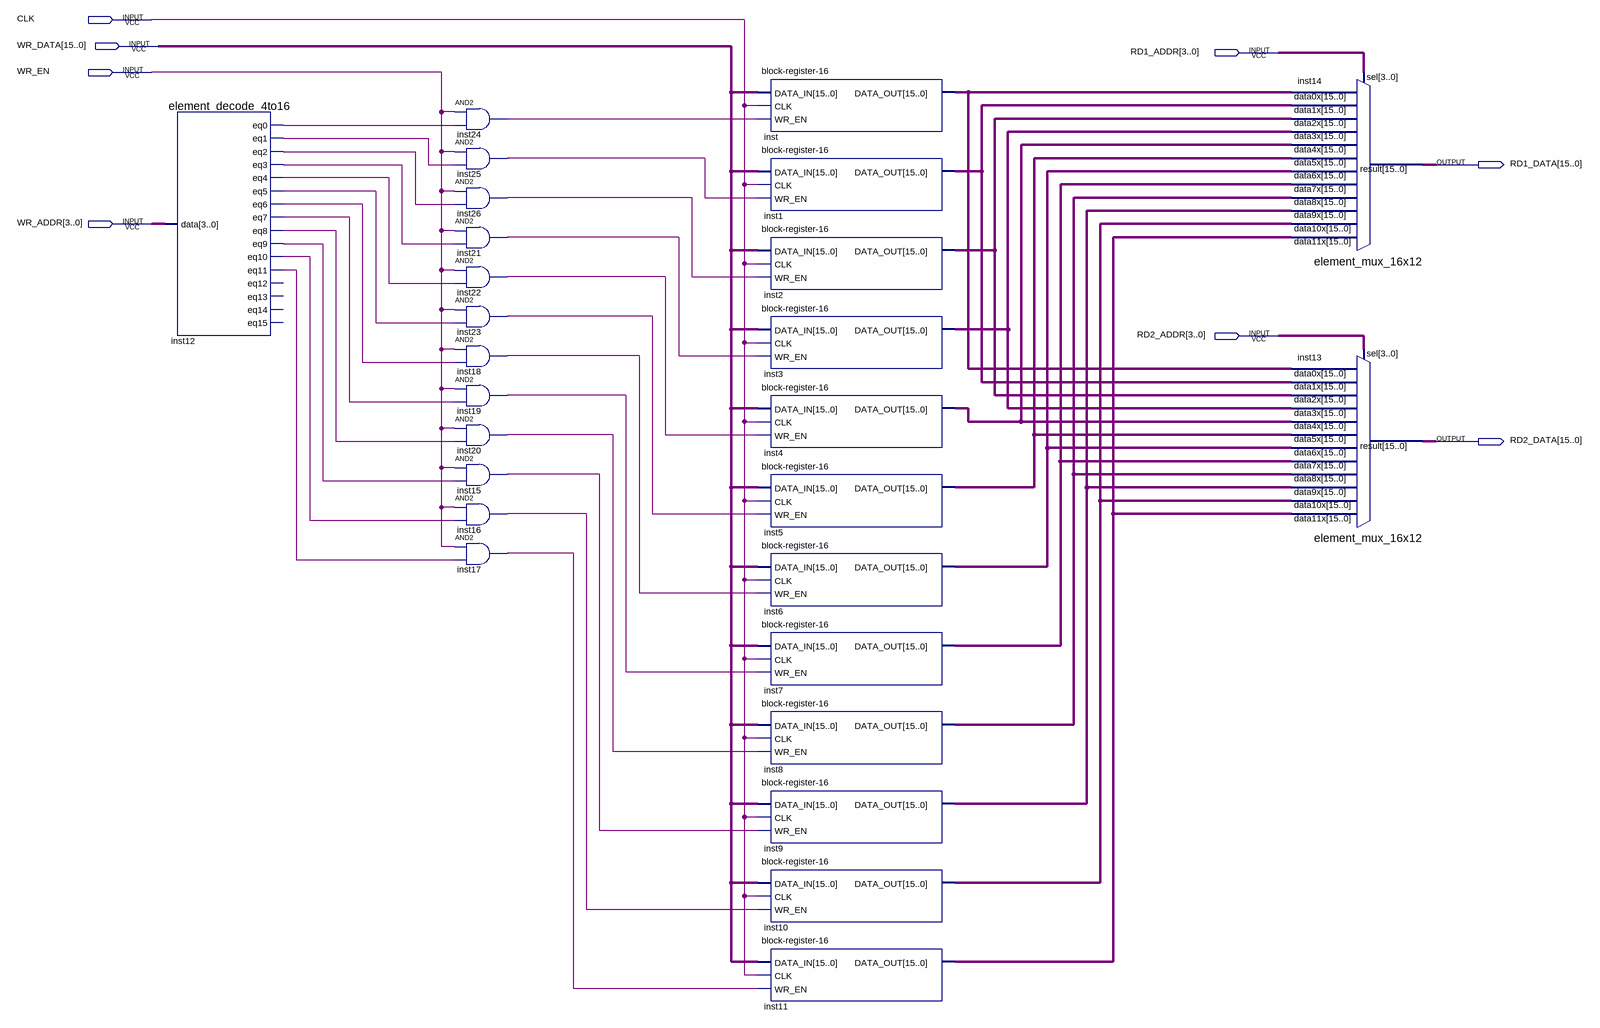
[diagram p0: schematic sheet]
// Quartus schematic block-register-file.bdf as structural Verilog: 27 symbols, 8 pins
module \block-register-file  (
  input  CLK,
  input  [15:0] WR_DATA,
  input  [3:0] RD1_ADDR,
  input  WR_EN,
  input  [3:0] WR_ADDR,
  input  [3:0] RD2_ADDR,
  output [15:0] RD1_DATA,
  output [15:0] RD2_DATA
);

  wire inst12_eq0, inst12_eq1, inst12_eq2, inst12_eq3, inst12_eq4, inst12_eq5, inst12_eq6, inst12_eq7,
       inst12_eq8, inst12_eq9, inst12_eq10, inst12_eq11, inst15_out, inst16_out, inst17_out, inst18_out,
       inst19_out, inst20_out, inst21_out, inst22_out, inst23_out, inst24_out, inst25_out, inst26_out;
  wire [15:0] inst1_data_out, inst2_data_out, inst3_data_out, inst4_data_out, inst5_data_out, inst6_data_out,
       inst7_data_out, inst8_data_out, inst9_data_out, inst10_data_out, inst11_data_out, inst_data_out;

  element_decode_4to16 inst12 (
    .data(WR_ADDR), .eq0(inst12_eq0), .eq1(inst12_eq1), .eq2(inst12_eq2), .eq3(inst12_eq3), .eq4(inst12_eq4),
    .eq5(inst12_eq5), .eq6(inst12_eq6), .eq7(inst12_eq7), .eq8(inst12_eq8), .eq9(inst12_eq9),
    .eq10(inst12_eq10), .eq11(inst12_eq11));  // open: eq12, eq13, eq14, eq15
  and inst24 (inst24_out, WR_EN, inst12_eq0);
  and inst25 (inst25_out, WR_EN, inst12_eq1);
  and inst26 (inst26_out, WR_EN, inst12_eq2);
  and inst21 (inst21_out, WR_EN, inst12_eq3);
  and inst22 (inst22_out, WR_EN, inst12_eq4);
  and inst23 (inst23_out, WR_EN, inst12_eq5);
  and inst18 (inst18_out, WR_EN, inst12_eq6);
  and inst19 (inst19_out, WR_EN, inst12_eq7);
  and inst20 (inst20_out, WR_EN, inst12_eq8);
  and inst15 (inst15_out, WR_EN, inst12_eq9);
  and inst16 (inst16_out, WR_EN, inst12_eq10);
  and inst17 (inst17_out, WR_EN, inst12_eq11);
  \block-register-16  inst (.DATA_IN(WR_DATA), .CLK(CLK), .WR_EN(inst24_out), .DATA_OUT(inst_data_out));
  \block-register-16  inst1 (.DATA_IN(WR_DATA), .CLK(CLK), .WR_EN(inst25_out), .DATA_OUT(inst1_data_out));
  \block-register-16  inst2 (.DATA_IN(WR_DATA), .CLK(CLK), .WR_EN(inst26_out), .DATA_OUT(inst2_data_out));
  \block-register-16  inst3 (.DATA_IN(WR_DATA), .CLK(CLK), .WR_EN(inst21_out), .DATA_OUT(inst3_data_out));
  \block-register-16  inst4 (.DATA_IN(WR_DATA), .CLK(CLK), .WR_EN(inst22_out), .DATA_OUT(inst4_data_out));
  \block-register-16  inst5 (.DATA_IN(WR_DATA), .CLK(CLK), .WR_EN(inst23_out), .DATA_OUT(inst5_data_out));
  \block-register-16  inst6 (.DATA_IN(WR_DATA), .CLK(CLK), .WR_EN(inst18_out), .DATA_OUT(inst6_data_out));
  \block-register-16  inst7 (.DATA_IN(WR_DATA), .CLK(CLK), .WR_EN(inst19_out), .DATA_OUT(inst7_data_out));
  \block-register-16  inst8 (.DATA_IN(WR_DATA), .CLK(CLK), .WR_EN(inst20_out), .DATA_OUT(inst8_data_out));
  \block-register-16  inst9 (.DATA_IN(WR_DATA), .CLK(CLK), .WR_EN(inst15_out), .DATA_OUT(inst9_data_out));
  \block-register-16  inst10 (.DATA_IN(WR_DATA), .CLK(CLK), .WR_EN(inst16_out), .DATA_OUT(inst10_data_out));
  \block-register-16  inst11 (.DATA_IN(WR_DATA), .CLK(CLK), .WR_EN(inst17_out), .DATA_OUT(inst11_data_out));
  element_mux_16x12 inst14 (
    .data11x(inst11_data_out), .data10x(inst10_data_out), .data9x(inst9_data_out), .data8x(inst8_data_out),
    .data7x(inst7_data_out), .data6x(inst6_data_out), .data5x(inst5_data_out), .data4x(inst4_data_out),
    .data3x(inst3_data_out), .data2x(inst2_data_out), .data1x(inst1_data_out), .data0x(inst_data_out),
    .sel(RD1_ADDR), .result(RD1_DATA));
  element_mux_16x12 inst13 (
    .data11x(inst11_data_out), .data10x(inst10_data_out), .data9x(inst9_data_out), .data8x(inst8_data_out),
    .data7x(inst7_data_out), .data6x(inst6_data_out), .data5x(inst5_data_out), .data4x(inst4_data_out),
    .data3x(inst3_data_out), .data2x(inst2_data_out), .data1x(inst1_data_out), .data0x(inst_data_out),
    .sel(RD2_ADDR), .result(RD2_DATA));
endmodule
